# Altium schematic sheet OSCILLAR_HFB_V1p0_ASYN.SchDoc
size A4; SheetNumber: 5; SheetTotal: 15; Title_: Aux synthesizer
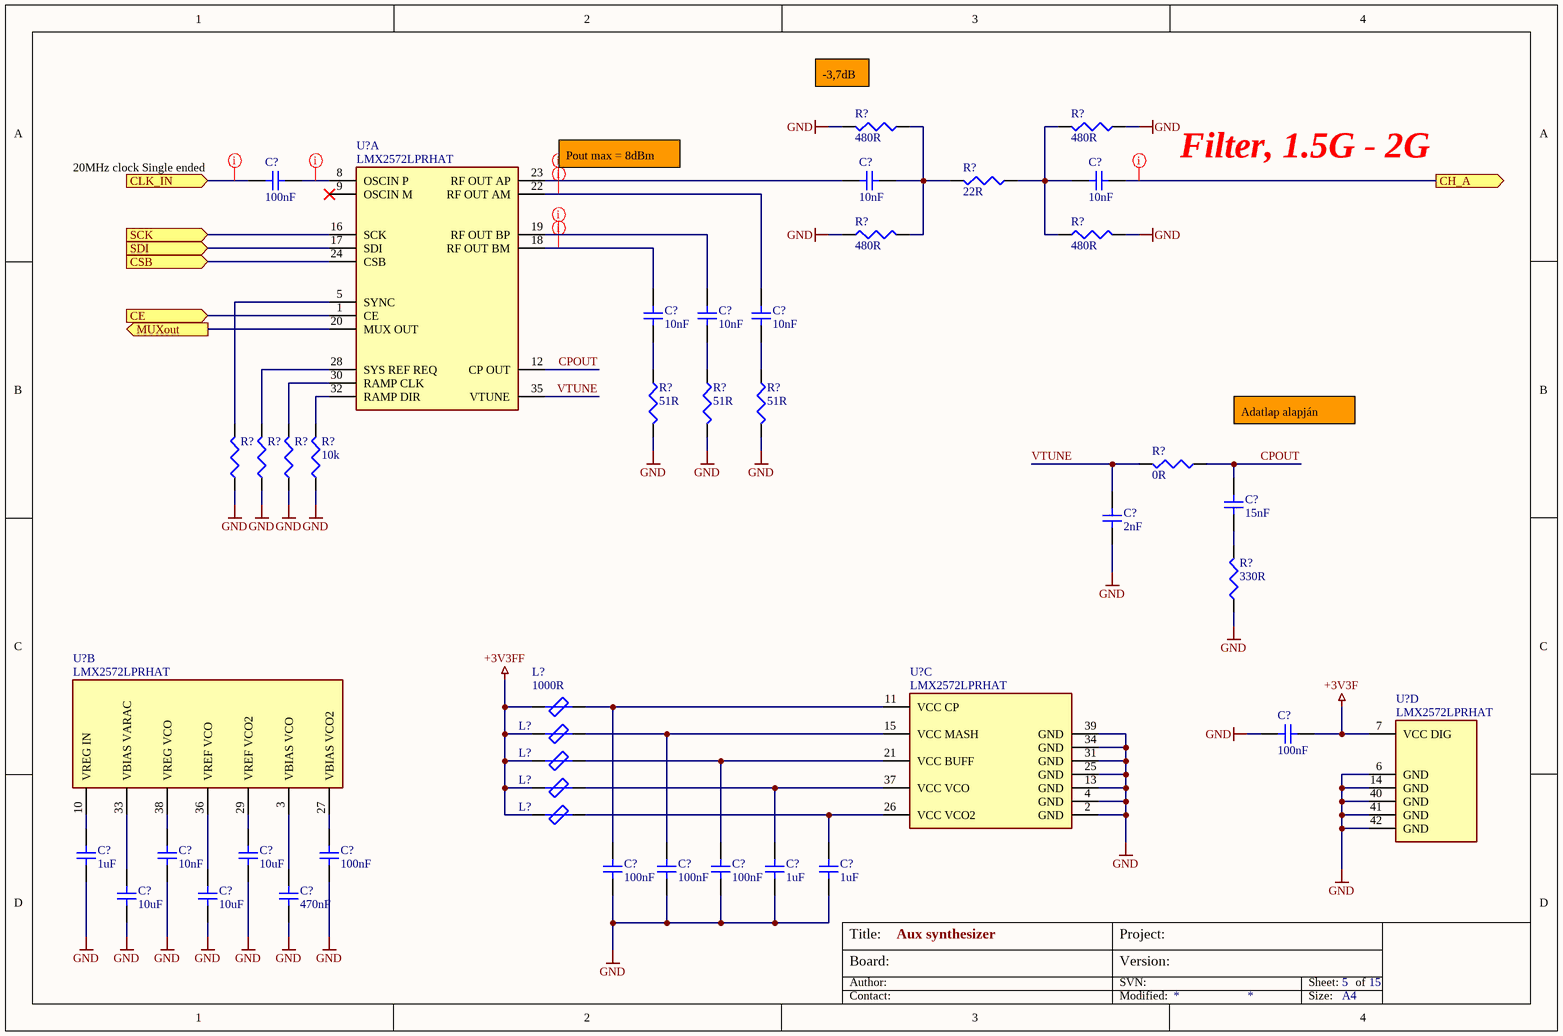
[diagram p0: OSCILLAR_HFB_V1p0_ASYN.SchDoc]

## Parts
(Parts that share a designator on the sheet are numbered #1, #2 ... from top to bottom, then left to right.)
C?#1  100nF  [CAP_0603]
C?#2  10nF  [CAP_0603]
C?#3  10nF  [CAP_0603]
C?#4  10nF  [CAP_0603]
C?#5  10nF  [CAP_0603]
C?#6  10nF  [CAP_0603]
C?#7  15nF  [CAP_0603]
C?#8  2nF  [CAP_0603]
C?#9  100nF  [CAP_0603]
C?#10  1uF  [CAP_0603]
C?#11  10nF  [CAP_0603]
C?#12  10uF  [CAP_0603]
C?#13  100nF  [CAP_0603]
C?#14  100nF  [CAP_0603]
C?#15  100nF  [CAP_0603]
C?#16  100nF  [CAP_0603]
C?#17  1uF  [CAP_0603]
C?#18  1uF  [CAP_0603]
C?#19  10uF  [CAP_0603]
C?#20  10uF  [CAP_0603]
C?#21  470nF  [CAP_0603]
L?#1  1000R  [IND-0805-EMI]
L?#2  1000R  [IND-0805-EMI]  (value not drawn)
L?#3  1000R  [IND-0805-EMI]  (value not drawn)
L?#4  1000R  [IND-0805-EMI]  (value not drawn)
L?#5  1000R  [IND-0805-EMI]  (value not drawn)
R?#1  480R  [RES-0603]
R?#2  480R  [RES-0603]
R?#3  22R  [RES-0805]
R?#4  480R  [RES-0603]
R?#5  480R  [RES-0603]
R?#6  51R  [RES-0603]
R?#7  51R  [RES-0603]
R?#8  51R  [RES-0603]
R?#9  51R  [RES-0603]  (value not drawn)
R?#10  51R  [RES-0603]  (value not drawn)
R?#11  51R  [RES-0603]  (value not drawn)
R?#12  10k  [RES-0603]
R?#13  0R  [RES-0603]
R?#14  330R  [RES-0603]
U?#1  LMX2572LPRHAT  [VQFN40-MAN]  (part A of 4)
U?#2  LMX2572LPRHAT  [VQFN40-MAN]  (part D of 4)
U?#3  LMX2572LPRHAT  [VQFN40-MAN]  (part C of 4)
U?#4  LMX2572LPRHAT  [VQFN40-MAN]  (part B of 4)

## Ports
CE (in, see OSCILLAR_HFB_V1p0_MAIN), CH_A (out, see OSCILLAR_HFB_V1p0_MAIN), CLK_IN (in, see OSCILLAR_HFB_V1p0_MAIN), CSB (in, see OSCILLAR_HFB_V1p0_MAIN), MUXout (out, see OSCILLAR_HFB_V1p0_MAIN), SCK (in, see OSCILLAR_HFB_V1p0_MAIN), SDI (in, see OSCILLAR_HFB_V1p0_MAIN)

## Nets
+3V3F: C?#9.2 U?#2.7(VCC_DIG)
+3V3FF: L?#1.1 L?#2.1 L?#3.1 L?#4.1 L?#5.1
GND: C?#8.2 C?#9.1 C?#10.2 C?#11.2 C?#12.2 C?#13.2 C?#14.1 C?#15.1 C?#16.1 C?#17.1 C?#18.1 C?#19.2 C?#20.2 C?#21.2 R?#1.2 R?#2.2 R?#4.1 R?#5.1 R?#6.2 R?#7.2 R?#8.2 R?#9.1 R?#10.1 R?#11.1 R?#12.1 R?#14.1 U?#2.6(GND) U?#2.14(GND) U?#2.40(GND) U?#2.41(GND) U?#2.42(GND) U?#3.2(GND) U?#3.4(GND) U?#3.13(GND) U?#3.25(GND) U?#3.31(GND) U?#3.34(GND) U?#3.39(GND)
CE: U?#1.1(CE) ; port CE
CH_A: C?#3.2 ; port CH_A
CLK_IN: C?#1.2 ; port CLK_IN
CPOUT: C?#7.2 R?#13.1 U?#1.12(CP_OUT)
CSB: U?#1.24(CSB) ; port CSB
MUXout: U?#1.20(MUX_OUT) ; port MUXout
SCK: U?#1.16(SCK) ; port SCK
SDI: U?#1.17(SDI) ; port SDI
VTUNE: C?#8.1 R?#13.2 U?#1.35(VTUNE)
NetC?#1_1: C?#1.1 U?#1.8(OSCIN_P)
NetC?#2_1: C?#2.1 R?#1.1 R?#3.2 R?#4.2
NetC?#2_2: C?#2.2 U?#1.23(RF_OUT_AP)
NetC?#3_1: C?#3.1 R?#2.1 R?#3.1 R?#5.2
NetC?#4_1: C?#4.1 U?#1.18(RF_OUT_BM)
NetC?#4_2: C?#4.2 R?#6.1
NetC?#5_1: C?#5.1 U?#1.19(RF_OUT_BP)
NetC?#5_2: C?#5.2 R?#7.1
NetC?#6_1: C?#6.1 U?#1.22(RF_OUT_AM)
NetC?#6_2: C?#6.2 R?#8.1
NetC?#7_1: C?#7.1 R?#14.2
NetC?#10_1: C?#10.1 U?#4.10(VREG_IN)
NetC?#11_1: C?#11.1 U?#4.38(VREG_VCO)
NetC?#12_1: C?#12.1 U?#4.29(VREF_VCO2)
NetC?#13_1: C?#13.1 U?#4.27(VBIAS_VCO2)
NetC?#14_2: C?#14.2 L?#1.2 U?#3.11(VCC_CP)
NetC?#15_2: C?#15.2 L?#2.2 U?#3.15(VCC_MASH)
NetC?#16_2: C?#16.2 L?#3.2 U?#3.21(VCC_BUFF)
NetC?#17_2: C?#17.2 L?#4.2 U?#3.37(VCC_VCO)
NetC?#18_2: C?#18.2 L?#5.2 U?#3.26(VCC_VCO2)
NetC?#19_1: C?#19.1 U?#4.33(VBIAS_VARAC)
NetC?#20_1: C?#20.1 U?#4.36(VREF_VCO)
NetC?#21_1: C?#21.1 U?#4.3(VBIAS_VCO)
NetR?#9_2: R?#9.2 U?#1.5(SYNC)
NetR?#10_2: R?#10.2 U?#1.28(SYS_REF_REQ)
NetR?#11_2: R?#11.2 U?#1.30(RAMP_CLK)
NetR?#12_2: R?#12.2 U?#1.32(RAMP_DIR)

Not connected (* = marked no-connect by the designer): U?#1 9(OSCIN_M)*

## Layout directives
net class 50R: CH_A, CLK_IN, NetC?#1_1, NetC?#2_2, NetC?#4_1, NetC?#5_1, NetC?#6_1

## Notes on the sheet
- (near R?#1) -3,7dB
- (near C?#1) 20MHz clock Single ended
- (near U?#1) Pout max = 8dBm
- Filter, 1.5G - 2G
- Adatlap alapján
- Board:
- Author:
- Title:
- Project:
- SVN:
- Version:
- Sheet:
- of
- Contact:
- Modified:
- Size:
- A4

## Library data of the parts
C?#1-C?#21 = NP-CAPACITOR: MLCC capacitor; Type: CAP
L?#1-L?#5 = BLM21SP102SN1D: Chip Ferrite Bead, 1000R @100MHz, 1.6A; Part number: 81-BLM21SP102SN1D; Type: IND; Supplier: Mouser; ComponentLink1Description: Datasheet; ComponentLink1URL: ENFA0005-1915781.pdf; ComponentLink2Description: Order; ComponentLink2URL: https://hu.mouser.com/ProductDetail/Murata-Electronics/BLM21SP102SN1D?qs=17u8i%2FzlE88oj6hmj%252BXptA%3D%3D
R?#1-R?#14 = RESISTOR: Metal Film Resistor; Type: RES
U?#1-U?#4 = LMX2572LPRHAT: Phase Locked Loop, PLL 2-GHz, low power, wideband RF synthesizer with FSK modulation; Part number: 595-LMX2572LPRHAT; Supplier: Mouser; Type: IC; ComponentLink1Description: Datasheet; ComponentLink1URL: lmx2572lp.pdf; ComponentLink2Description: Order; ComponentLink2URL: https://eu.mouser.com/ProductDetail/Texas-Instruments/LMX2572LPRHAT?qs=gTYE2QTfZfSA3i5JNKijBA%3D%3D